# Altium project Benchtest.PrjPcb
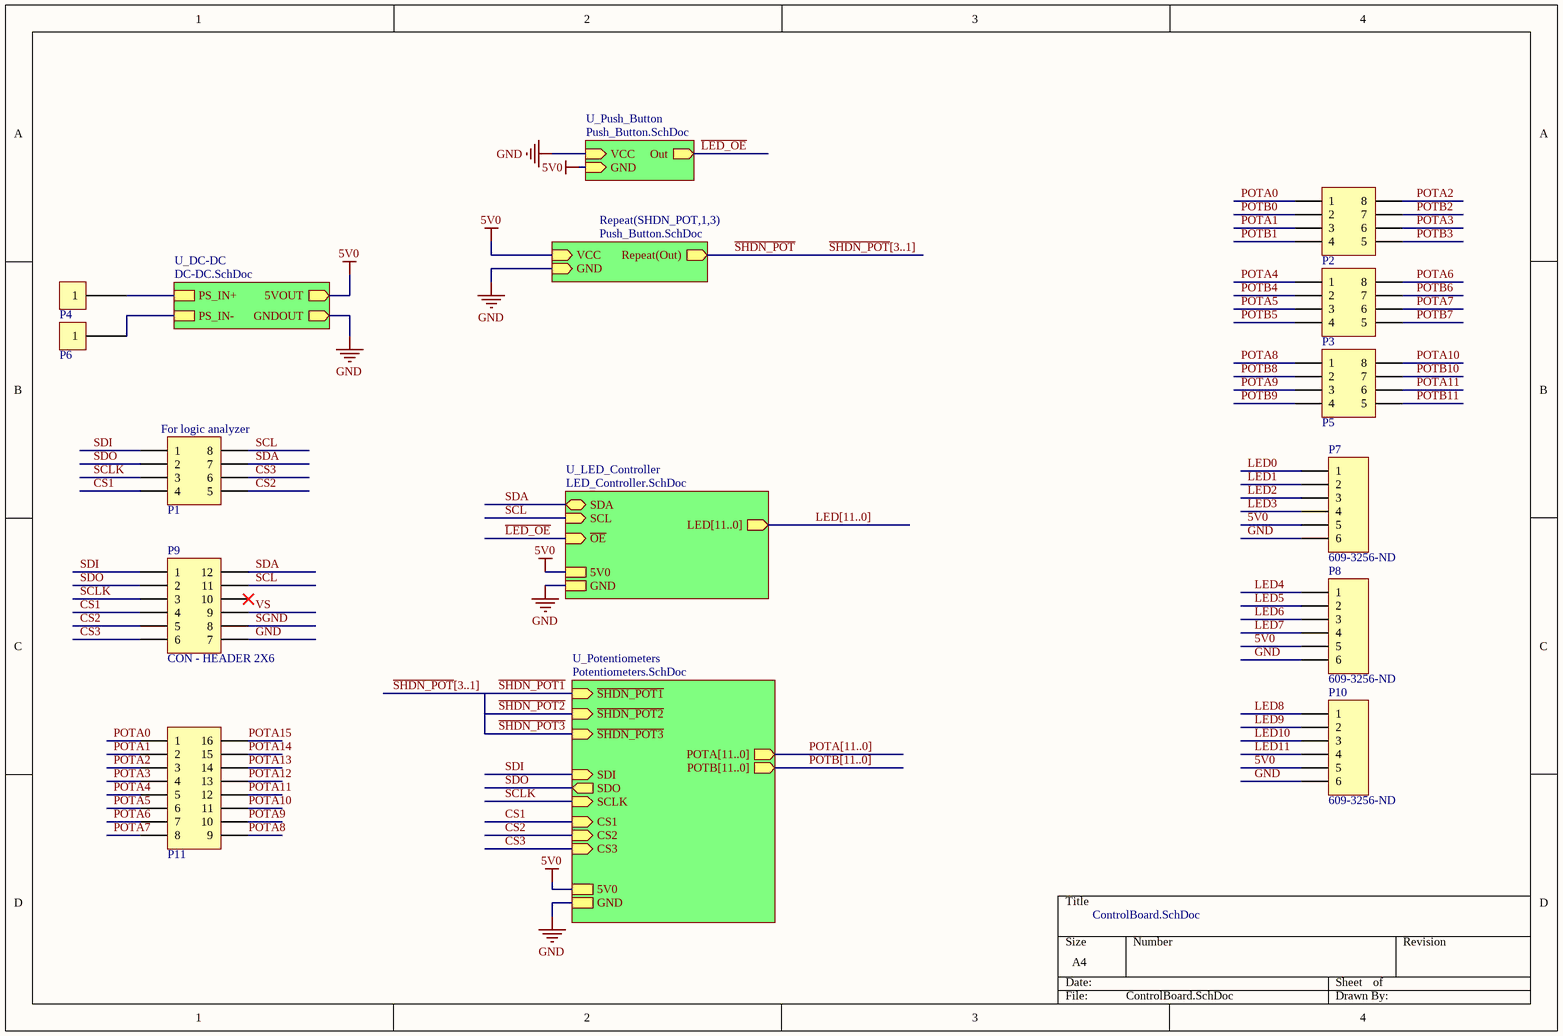
[diagram p0: ControlBoard.SchDoc]
7 sheets, 81 parts. Net scope: hierarchical (ports join the sheet entries above them; power ports are global).
Board file: ControlBoard.PcbDoc
Sheets:
  ControlBoard.SchDoc
    U_LED_Controller = LED_Controller.SchDoc
    U_Potentiometers = Potentiometers.SchDoc
      U_Potentiometer = Potentiometer.SchDoc
      U_Potentiometer = Potentiometer.SchDoc
      U_Potentiometer = Potentiometer.SchDoc
    SHDN_POT1 = Push_Button.SchDoc
    SHDN_POT2 = Push_Button.SchDoc
    SHDN_POT3 = Push_Button.SchDoc
    U_Push_Button = Push_Button.SchDoc
    U_DC-DC = DC-DC.SchDoc
  Signal_Protection.SchDoc

## Sheet ControlBoard.SchDoc
size A4

### Parts
P1  CON - HEADER 2X4  [CON-HEADER-2X4]  (value not drawn)
P2  CON - HEADER 2X4  [CON-HEADER-2X4]  (value not drawn)
P3  CON - HEADER 2X4  [CON-HEADER-2X4]  (value not drawn)
P4  CON - BANANA  [CON-PCB BANANA RED]  (value not drawn)
P5  CON - HEADER 2X4  [CON-HEADER-2X4]  (value not drawn)
P6  CON - BANANA  [CON-PCB BANANA BLACK]  (value not drawn)
P7  Supplier Part Number 1: 609-3256-ND  [CON-HEADER-1X6]  (hidden comment: CON - HEADER 1X6)
P8  Supplier Part Number 1: 609-3256-ND  [CON-HEADER-1X6]  (hidden comment: CON - HEADER 1X6)
P9  CON - HEADER 2X6  [CON-HEADER-2X6]
P10  Supplier Part Number 1: 609-3256-ND  [CON-HEADER-1X6]  (hidden comment: CON - HEADER 1X6)
P11  CON - HEADER 2X8  [CON-HEADER-2X8]  (value not drawn)

### Sub-sheets
Repeat(SHDN_POT,1,3) = Push_Button.SchDoc: Repeat(Out) (out), GND (in), VCC (in)
U_DC-DC = DC-DC.SchDoc: 5VOUT (out), PS_IN+, PS_IN-, GNDOUT (out)
U_LED_Controller = LED_Controller.SchDoc: SDA (bidir), SCL (in), ~{OE} (in), 5V0, GND, LED[11..0] (out)
U_Potentiometers = Potentiometers.SchDoc: SDI (in), SCLK (in), CS1 (in), CS2 (in), CS3 (in), 5V0, GND, SDO (out), ~{SHDN_POT3} (in), ~{SHDN_POT2} (in), ~{SHDN_POT1} (in), POTA[11..0] (out), POTB[11..0] (out)
U_Push_Button = Push_Button.SchDoc: Out (out), VCC (in), GND (in)

### Nets
5V0: P6.1 P7.5 P7.6 P8.5 P8.6 P9.7 P10.5 P10.6 ; sheet U_LED_Controller/5V0, sheet U_LED_Controller/GND, sheet U_Potentiometers/5V0, sheet U_Potentiometers/GND, sheet Repeat(SHDN_POT,1,3)/GND, sheet Repeat(SHDN_POT,1,3)/VCC, sheet U_Push_Button/VCC, sheet U_Push_Button/GND, sheet U_DC-DC/5VOUT, sheet U_DC-DC/PS_IN-, sheet U_DC-DC/GNDOUT  [also labelled GND]
CS1: P1.4 P9.4 ; sheet U_Potentiometers/CS1
CS2: P1.5 P9.5 ; sheet U_Potentiometers/CS2
CS3: P1.6 P9.6 ; sheet U_Potentiometers/CS3
~{LED_OE}: sheet U_LED_Controller/~{OE}, sheet U_Push_Button/Out
LED0: P7.1
LED1: P7.2
LED2: P7.3
LED3: P7.4
LED4: P8.1
LED5: P8.2
LED6: P8.3
LED7: P8.4
LED8: P10.1
LED9: P10.2
LED10: P10.3
LED11: P10.4
POTA0: P2.1 P11.1
POTA1: P2.3 P11.2
POTA2: P2.8 P11.3
POTA3: P2.6 P11.4
POTA4: P3.1 P11.5
POTA5: P3.3 P11.6
POTA6: P3.8 P11.7
POTA7: P3.6 P11.8
POTA8: P5.1 P11.9
POTA9: P5.3 P11.10
POTA10: P5.8 P11.11
POTA11: P5.6 P11.12
POTA12: P11.13
POTA13: P11.14
POTA14: P11.15
POTA15: P11.16
POTB0: P2.2
POTB1: P2.4
POTB2: P2.7
POTB3: P2.5
POTB4: P3.2
POTB5: P3.4
POTB6: P3.7
POTB7: P3.5
POTB8: P5.2
POTB9: P5.4
POTB10: P5.7
POTB11: P5.5
~{SHDN_POT}: sheet Repeat(SHDN_POT,1,3)/Repeat(Out)
SCL: P1.8 P9.11 ; sheet U_LED_Controller/SCL
SCLK: P1.3 P9.3 ; sheet U_Potentiometers/SCLK
SDA: P1.7 P9.12 ; sheet U_LED_Controller/SDA
SDI: P1.1 P9.1 ; sheet U_Potentiometers/SDI
SDO: P1.2 P9.2 ; sheet U_Potentiometers/SDO
SGND: P9.8
VS: P9.9
NetF1_1: P4.1 ; sheet U_DC-DC/PS_IN+

Not connected (* = marked no-connect by the designer): P9 10*

### Buses and harness runs
bus LED[11..0] = sheet U_LED_Controller/LED[11..0]
bus POTA[11..0] = sheet U_Potentiometers/POTA[11..0]
bus POTB[11..0] = sheet U_Potentiometers/POTB[11..0]
bus ~{SHDN_POT}[3..1]

### Notes on the sheet
- (near P1) For logic analyzer

### Library data of the parts
P1-P3 P5 = CON - HEADER 2X4: 100mil header 2 row 8pins; Manufacturer: *; (FIELD A): *; (FIELD B): *; (FIELD C): *; Supplier 1: Digi-Key; Supplier Part Number 1: 952-2122-ND
P7 P8 P10 = CON - HEADER 1X6: 100mil header 1 row 6 pins; Manufacturer: *; (FIELD A): *; (FIELD B): *; (FIELD C): *; Supplier 1: Digi-Key
P9 = CON - HEADER 2X6: 100mil header 2 row 12pins; Manufacturer: *; (FIELD A): *; (FIELD B): *; (FIELD C): *; Supplier 1: Digi-Key; Supplier Part Number 1: 952-2125-ND
P11 = CON - HEADER 2X8: 100mil header 2 row 16pins; Manufacturer: *; (FIELD A): *; (FIELD B): *; (FIELD C): *; Supplier 1: Digi-Key; Supplier Part Number 1: 952-2128-ND
P4 P6 = CON - BANANA: Supplier 1: Digi-Key; Supplier 2: Digi-Key; Supplier Part Number 1: J110-ND; Supplier Part Number 2: J109-ND

## Sheet LED_Controller.SchDoc
size A4
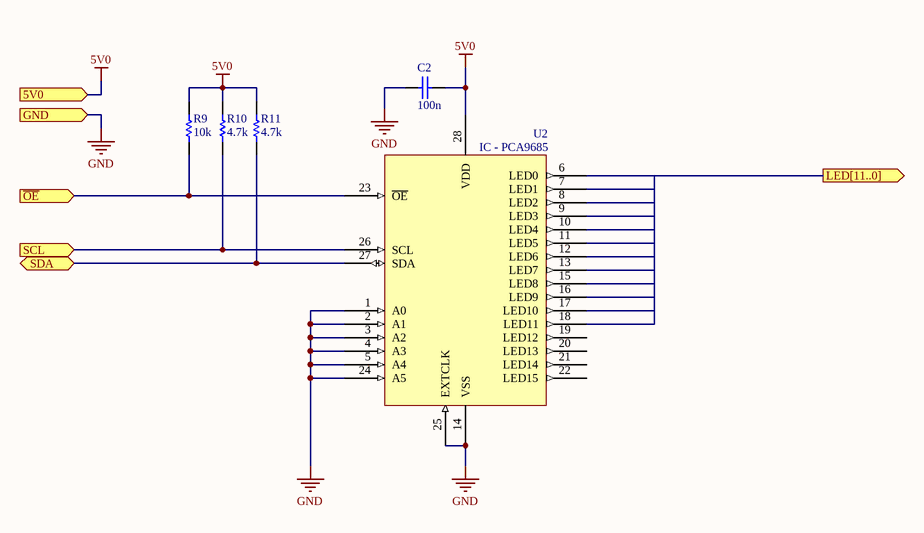
[diagram p1: LED_Controller.SchDoc]

### Parts
C2  value 100n  [CS-0603]  (hidden comment: CS - CAPACITOR)
R9  value 10k  [RS-0402]  (hidden comment: RS - RESISTOR)
R10  value 4.7k  [RS-0402]  (hidden comment: RS - RESISTOR)
R11  value 4.7k  [RS-0402]  (hidden comment: RS - RESISTOR)
U2  IC - PCA9685  [IC-TSSOP-28]

### Ports
5V0, GND, LED[11..0] (out), SCL (in), SDA (bidir), ~{OE} (in)

### Nets
5V0: C2.1 C2.2 R9.2 R10.2 R11.2 U2.1(A0) U2.2(A1) U2.3(A2) U2.4(A3) U2.5(A4) U2.14(VSS) U2.24(A5) U2.25(EXTCLK) U2.28(VDD) ; port 5V0, port GND  [also labelled GND]
~{LED_OE}: R9.1 U2.23(~{OE}) ; port ~{OE}
SCL: R10.1 U2.26(SCL) ; port SCL
SDA: R11.1 U2.27(SDA) ; port SDA

Not connected (* = marked no-connect by the designer): U2 6(LED0) 7(LED1) 8(LED2) 9(LED3) 10(LED4) 11(LED5) 12(LED6) 13(LED7) 15(LED8) 16(LED9) 17(LED10) 18(LED11) 19(LED12) 20(LED13) 21(LED14) 22(LED15)

### Library data of the parts
C2 = CS - CAPACITOR: TOLERANCE: 10%; VOLTAGE: 16V; Supplier 1: *; Supplier Part Number 1: *; (FIELD A): *; (FLIED C): *; (FIELD B): *; Manufacturer: *
R9-R11 = RS - RESISTOR: TOLERANCE: RES TOL; POWER: RES POWER; Supplier Part Number 1: *; Supplier 1: *; (FIELD A): *; (FLIED C): *; (FIELD B): *; Manufacturer: *
U2 = IC - PCA9685: 16-channel, 12-bit PWM Fm + I2C-bus LED controller; Manufacturer: Allegro; Supplier 1: Digi-Key; Supplier Part Number 1: 568-11925-2-ND; (FLIED A): *; (FLIED B): *; (FLIED C): *

## Sheet Potentiometers.SchDoc
size A4
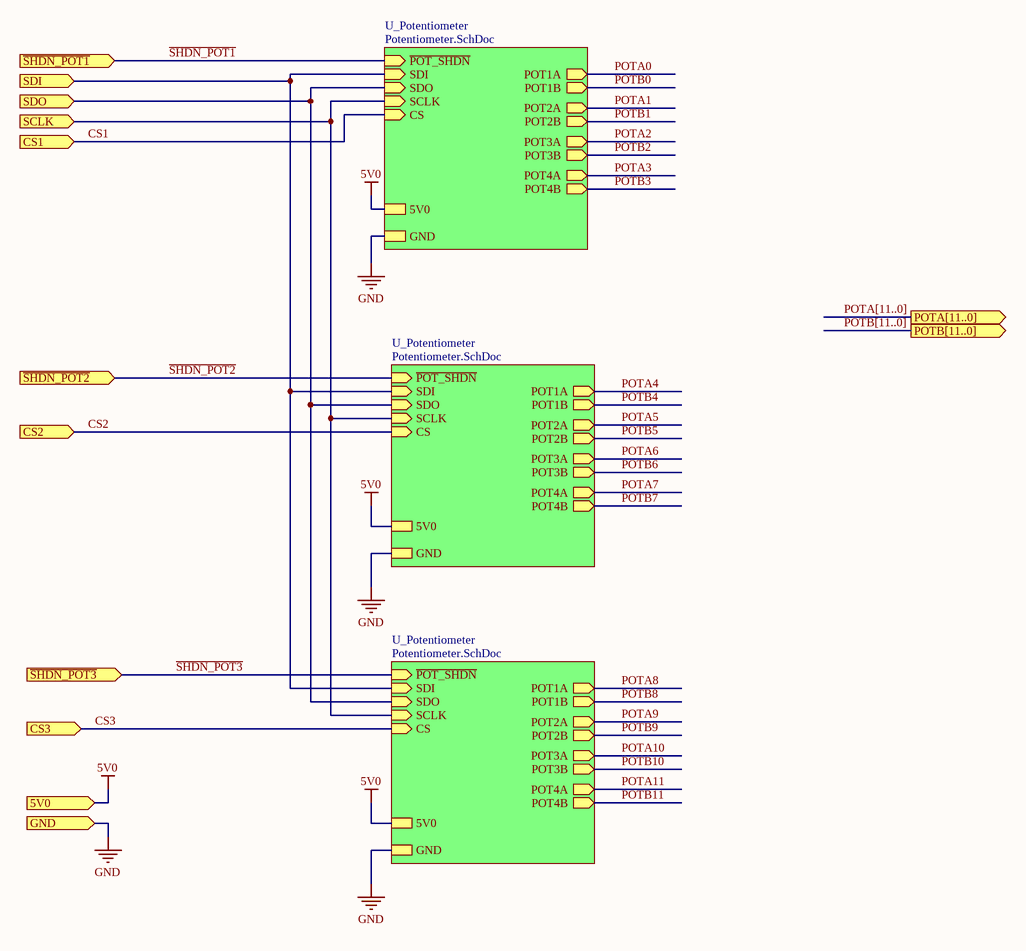
[diagram p2: Potentiometers.SchDoc]

### Sub-sheets
U_Potentiometer = Potentiometer.SchDoc: SDI (in), SDO (in), SCLK (in), CS (in), POT1A (out), POT1B (out), POT2A (out), POT2B (out), POT3A (out), POT3B (out), POT4A (out), POT4B (out), 5V0, GND, ~{POT_SHDN} (in)
U_Potentiometer = Potentiometer.SchDoc: SDI (in), SDO (in), SCLK (in), CS (in), POT1A (out), POT1B (out), POT2A (out), POT2B (out), POT3A (out), POT3B (out), POT4A (out), POT4B (out), 5V0, GND, ~{POT_SHDN} (in)
U_Potentiometer = Potentiometer.SchDoc: SDI (in), SDO (in), SCLK (in), CS (in), POT1A (out), POT1B (out), POT2A (out), POT2B (out), POT3A (out), POT3B (out), POT4A (out), POT4B (out), 5V0, GND, ~{POT_SHDN} (in)

### Ports
5V0, CS1 (in), CS2 (in), CS3 (in), GND, POTA[11..0] (out), POTB[11..0] (out), SCLK (in), SDI (in), SDO (in), ~{SHDN_POT1} (in), ~{SHDN_POT2} (in), ~{SHDN_POT3} (in)

### Nets
5V0: port 5V0, port GND, sheet U_Potentiometer/5V0, sheet U_Potentiometer/GND, sheet U_Potentiometer/5V0, sheet U_Potentiometer/GND, sheet U_Potentiometer/5V0, sheet U_Potentiometer/GND  [also labelled GND]
CS1: port CS1, sheet U_Potentiometer/CS
CS2: port CS2, sheet U_Potentiometer/CS
CS3: port CS3, sheet U_Potentiometer/CS
~{SHDN_POT1}: port ~{SHDN_POT1}, sheet U_Potentiometer/~{POT_SHDN}
~{SHDN_POT2}: port ~{SHDN_POT2}, sheet U_Potentiometer/~{POT_SHDN}
~{SHDN_POT3}: port ~{SHDN_POT3}, sheet U_Potentiometer/~{POT_SHDN}
SCLK: port SCLK, sheet U_Potentiometer/SCLK, sheet U_Potentiometer/SCLK, sheet U_Potentiometer/SCLK
SDI: port SDI, sheet U_Potentiometer/SDI, sheet U_Potentiometer/SDI, sheet U_Potentiometer/SDI
SDO: port SDO, sheet U_Potentiometer/SDO, sheet U_Potentiometer/SDO, sheet U_Potentiometer/SDO

### Buses and harness runs
bus POTA[11..0] = port POTA[11..0]
bus POTB[11..0] = port POTB[11..0]

## Sheet Potentiometer.SchDoc
size A4
Used 3 times, as channels U_Potentiometers/U_Potentiometer, U_Potentiometers/U_Potentiometer, U_Potentiometers/U_Potentiometer. Parts and nets are listed once, with the designators drawn on the sheet.
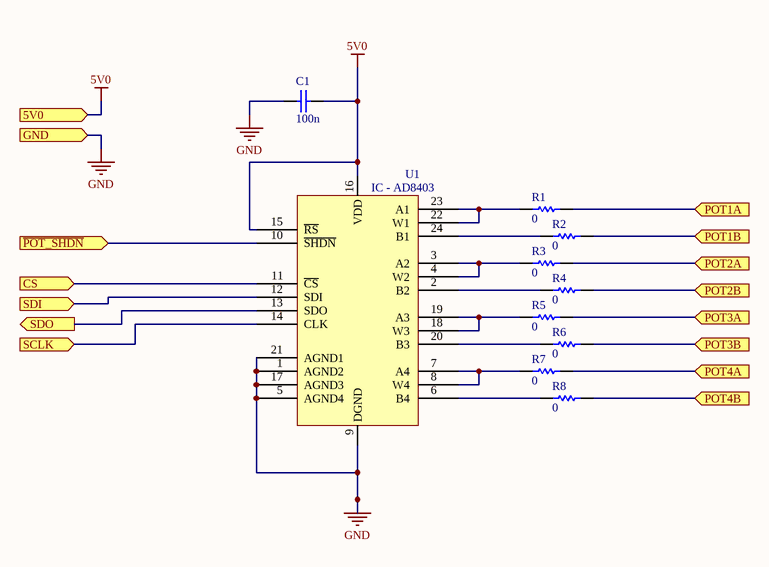
[diagram p3: Potentiometer.SchDoc]

### Parts
C1  value 100n  [CS-0603]  (hidden comment: CS - CAPACITOR)
R1  value 0  [RS-0402]  (hidden comment: RS - RESISTOR)
R2  value 0  [RS-0402]  (hidden comment: RS - RESISTOR)
R3  value 0  [RS-0402]  (hidden comment: RS - RESISTOR)
R4  value 0  [RS-0402]  (hidden comment: RS - RESISTOR)
R5  value 0  [RS-0402]  (hidden comment: RS - RESISTOR)
R6  value 0  [RS-0402]  (hidden comment: RS - RESISTOR)
R7  value 0  [RS-0402]  (hidden comment: RS - RESISTOR)
R8  value 0  [RS-0402]  (hidden comment: RS - RESISTOR)
U1  IC - AD8403  [IC-SOIC-24]

### Ports
5V0, CS (in), GND, POT1A (in), POT1B (in), POT2A (in), POT2B (in), POT3A (in), POT3B (in), POT4A (in), POT4B (in), SCLK (in), SDI (in), SDO (out), ~{POT_SHDN} (in)

### Nets
5V0: C1.1 U1.15(~{RS}) U1.16(VDD) ; port 5V0
GND: C1.2 U1.1(AGND2) U1.5(AGND4) U1.9(DGND) U1.17(AGND3) U1.21(AGND1) ; port GND
CS: U1.11(~{CS}) ; port CS
~{POT_SHDN}: U1.10(~{SHDN}) ; port ~{POT_SHDN}
POT1A: R1.1 ; port POT1A
POT1B: R2.1 ; port POT1B
POT2A: R3.1 ; port POT2A
POT2B: R4.1 ; port POT2B
POT3A: R5.1 ; port POT3A
POT3B: R6.1 ; port POT3B
POT4A: R7.1 ; port POT4A
POT4B: R8.1 ; port POT4B
SCLK: U1.14(CLK) ; port SCLK
SDI: U1.12(SDI) ; port SDI
SDO: U1.13(SDO) ; port SDO
NetR1_2: R1.2 U1.22(W1) U1.23(A1)
NetR2_2: R2.2 U1.24(B1)
NetR3_2: R3.2 U1.3(A2) U1.4(W2)
NetR4_2: R4.2 U1.2(B2)
NetR5_2: R5.2 U1.18(W3) U1.19(A3)
NetR6_2: R6.2 U1.20(B3)
NetR7_2: R7.2 U1.7(A4) U1.8(W4)
NetR8_2: R8.2 U1.6(B4)

### Channels
U_Potentiometers/U_Potentiometer: designators end in _U_Potentiometer3; ports 5V0=5V0 CS=CS3 GND=5V0 POT1A=POTA8 POT1B=POTB8 POT2A=POTA9 POT2B=POTB9 POT3A=POTA10 POT3B=POTB10 POT4A=POTA11 POT4B=POTB11 SCLK=SCLK SDI=SDI SDO=SDO ~{POT_SHDN}=~{SHDN_POT3}
U_Potentiometers/U_Potentiometer: designators end in _U_Potentiometer2; ports 5V0=5V0 CS=CS1 GND=5V0 POT1A=POTA0 POT1B=POTB0 POT2A=POTA1 POT2B=POTB1 POT3A=POTA2 POT3B=POTB2 POT4A=POTA3 POT4B=POTB3 SCLK=SCLK SDI=SDI SDO=SDO ~{POT_SHDN}=~{SHDN_POT1}
U_Potentiometers/U_Potentiometer: designators end in _U_Potentiometer1; ports 5V0=5V0 CS=CS2 GND=5V0 POT1A=POTA4 POT1B=POTB4 POT2A=POTA5 POT2B=POTB5 POT3A=POTA6 POT3B=POTB6 POT4A=POTA7 POT4B=POTB7 SCLK=SCLK SDI=SDI SDO=SDO ~{POT_SHDN}=~{SHDN_POT2}

### Library data of the parts
C1 = CS - CAPACITOR: TOLERANCE: 10%; VOLTAGE: 16V; Supplier 1: *; Supplier Part Number 1: *; (FIELD A): *; (FLIED C): *; (FIELD B): *; Manufacturer: *
R1-R8 = RS - RESISTOR: TOLERANCE: RES TOL; POWER: RES POWER; Supplier Part Number 1: *; Supplier 1: *; (FIELD A): *; (FLIED C): *; (FIELD B): *; Manufacturer: *
U1 = IC - AD8403: DIGITAL POTENTIOMETER; (FIELD A): *; (FIELD B): *; (FIELD C): *; Manufacturer: *; Supplier 1: Digi-Key; Supplier Part Number 1: AD8403ARZ10-ND

## Sheet Push_Button.SchDoc
size A4
Used 4 times, as channels SHDN_POT1, SHDN_POT2, SHDN_POT3, U_Push_Button. Parts and nets are listed once, with the designators drawn on the sheet.
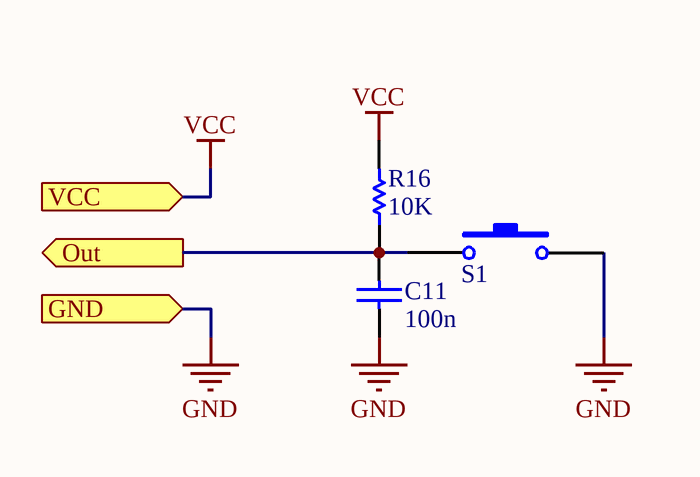
[diagram p4: Push_Button.SchDoc]

### Parts
C11  value 100n  [CS-0603]  (hidden comment: CS - CAPACITOR)
R16  value 10K  [RS-0603]  (hidden comment: RS - RESISTOR)
S1  SW - Tactile Switch  [SW-FSMSM]  (value not drawn)

### Ports
GND (in), Out (out), VCC (in)

### Nets
GND: C11.1 S1.2 ; port GND
VCC: R16.2 ; port VCC
Out: C11.2 R16.1 S1.1 ; port Out

### Channels
SHDN_POT1: designators end in _SHDN_POT1; ports GND=5V0 Out=~{SHDN_POT}1 VCC=5V0
SHDN_POT2: designators end in _SHDN_POT2; ports GND=5V0 Out=~{SHDN_POT}2 VCC=5V0
SHDN_POT3: designators end in _SHDN_POT3; ports GND=5V0 Out=~{SHDN_POT}3 VCC=5V0
U_Push_Button: designators end in _U_Push_Button; ports GND=5V0 Out=~{LED_OE} VCC=5V0

### Library data of the parts
C11 = CS - CAPACITOR: TOLERANCE: 10%; VOLTAGE: 16V; Supplier 1: *; Supplier Part Number 1: 490-1532-1-ND; (FIELD A): *; (FLIED C): *; (FIELD B): *; Manufacturer: *
R16 = RS - RESISTOR: TOLERANCE: RES TOL; POWER: RES POWER; Supplier Part Number 1: *; Supplier 1: *; (FIELD A): *; (FLIED C): *; (FIELD B): *; Manufacturer: *
S1 = SW - Tactile Switch: Supplier 1: Digi-Key; Supplier Part Number 1: 450-1658-ND; (FLIED A): *; (FLIED B): *; (FLIED C): *; Manufacturer: *; Supplier 2: Digi-Key; Supplier Part Number 2: 450-1758-2-ND

## Sheet DC-DC.SchDoc
size A4
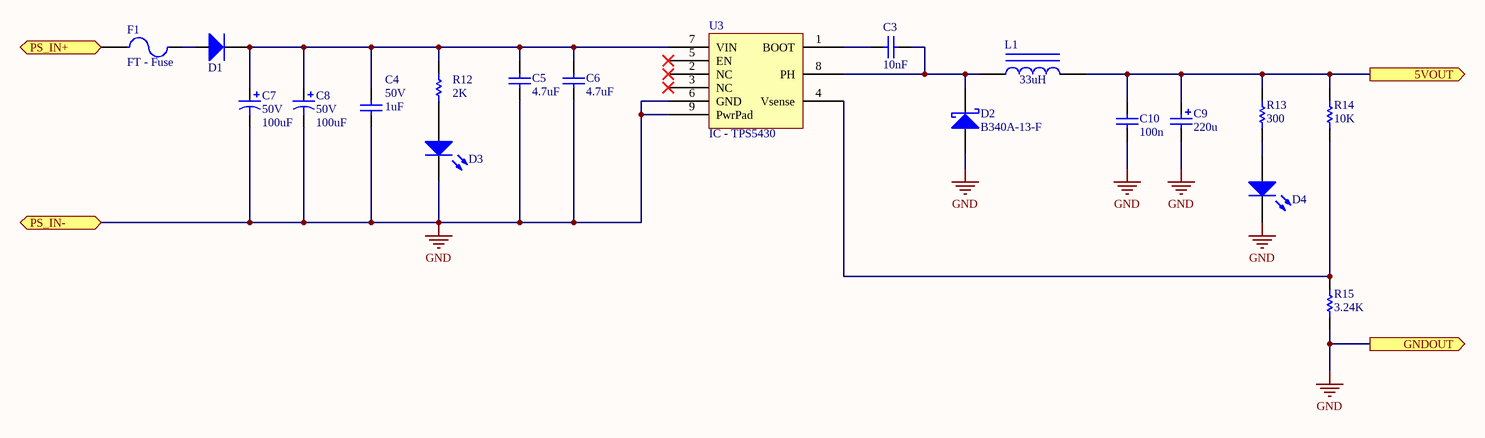
[diagram p5: DC-DC.SchDoc]

### Parts
C3  value 10nF  [CS-0603]  (hidden comment: CS - CAPACITOR)
C4  value 1uF  VOLTAGE: 50V  [CS-0603]  (hidden comment: CS - CAPACITOR)
C5  value 4.7uF  [CS-1206]  (hidden comment: CS - CAPACITOR)
C6  value 4.7uF  [CS-1206]  (hidden comment: CS - CAPACITOR)
C7  value 100uF  VOLTAGE: 50V  [CT-CAP-ALUM-8X14]  (hidden comment: CT - CAPACITOR ELECTROLYTIC)
C8  value 100uF  VOLTAGE: 50V  [CT-CAP-ALUM-8X14]  (hidden comment: CT - CAPACITOR ELECTROLYTIC)
C9  value 220u  [CS-POL-2312]  (hidden comment: CS - CAPACITOR POL)
C10  value 100n  [CS-0603]  (hidden comment: CS - CAPACITOR)
D1  DT - Diode  [IC-TO-220-2-DIODE]  (value not drawn)
D2  B340A-13-F  [DS - DO-214AC-SMA]
D3  LED - NORMAL LED  [LED-0603 YELLOW]  (value not drawn)
D4  LED - NORMAL LED  [LED-0603 YELLOW]  (value not drawn)
F1  FT - Fuse  [FT - 5mm x 20mm]
L1  value 33uH  [LS-Inductor SMD]  (hidden comment: LS - INDUCTOR)
R12  value 2K  [RS-0603]  (hidden comment: RS - RESISTOR)
R13  value 300  [RS-0603]  (hidden comment: RS - RESISTOR)
R14  value 10K  [RS-0603]  (hidden comment: RS - RESISTOR)
R15  value 3.24K  [RS-0603]  (hidden comment: RS - RESISTOR)
U3  IC - TPS5430  [IC-SOIC8-POWERPAD]

### Ports
5VOUT (out), GNDOUT (out), PS_IN+, PS_IN-

### Nets
GND: C4.1 C5.1 C6.1 C7.2 C8.2 C9.1 C9.2 C10.1 C10.2 D2.A D3.K D4.K L1.2 R13.1 R14.1 R15.2 U3.6(GND) U3.9(PwrPad) ; port 5VOUT, port PS_IN-, port GNDOUT  [project net 5V0]
NetC3_1: C3.1 D2.K L1.1 U3.8(PH)
NetC3_2: C3.2 U3.1(BOOT)
NetC4_2: C4.2 C5.2 C6.2 C7.1 C8.1 D1.K R12.2 U3.7(VIN)
NetD1_A: D1.A F1.2
NetD3_A: D3.A R12.1
NetD4_A: D4.A R13.2
NetF1_1: F1.1 ; port PS_IN+
NetR14_2: R14.2 R15.1 U3.4(Vsense)

Not connected (* = marked no-connect by the designer): U3 2(NC)* 3(NC)* 5(EN)*

### Library data of the parts
C3 = CS - CAPACITOR: CAP CER 10000PF 50V 10% X7R 0603; Manufacturer: TDK; (FIELD A): Tantalum; VOLTAGE: 16V; Supplier 1: Digikey; Supplier Part Number 1: 445-1311-1-ND; (FLIED C): *; (FIELD B): *; TOLERANCE: 10%
C4 = CS - CAPACITOR: TOLERANCE: 10%; Supplier 1: *; Supplier Part Number 1: *; (FIELD A): *; (FLIED C): *; (FIELD B): *; Manufacturer: *
C5 C6 = CS - CAPACITOR: Manufacturer: Samsung; TOLERANCE: 10%; VOLTAGE: 16V; Supplier 1: Digikey; Supplier Part Number 1: 1276-1292-1-ND; (FIELD A): *; (FLIED C): *; (FIELD B): *
C7 C8 = CT - CAPACITOR ELECTROLYTIC: TOLERANCE: 10%; Supplier 1: *; Supplier Part Number 1: *; (FIELD A): *; (FLIED C): *; (FIELD B): *; Manufacturer: *
C9 = CS - CAPACITOR POL: TOLERANCE: 10%; Supplier 1: *; Supplier Part Number 1: *; (FIELD A): *; (FLIED C): *; (FIELD B): *; Manufacturer: *; VOLTAGE: VOLTAGE; Supplier 2: Digi-Key; Supplier Part Number 2: 478-5236-1-ND
C10 = CS - CAPACITOR: TOLERANCE: 10%; VOLTAGE: 16V; Supplier 1: *; Supplier Part Number 1: 490-1532-1-ND; (FIELD A): *; (FLIED C): *; (FIELD B): *; Manufacturer: *
D1 = DT - Diode: Zener Schottky; Supplier Part Number 1: *; Supplier 1: *; FORWARS VOLTAGE: *; (FIELD A): *; (FIELD B): *; (FIELD C): *; Manufacturer: *; CURRENT MAX: *; Supplier 2: Digi-Key; Supplier Part Number 2: MBR1645-E3/45GI-ND
D2 = DS - Schottky: DIODE SCHOTTKY 40V 3A SMA; Manufacturer: Diodes Incorporated; Supplier Part Number 1: B340A-FDICT-ND; Supplier 1: Digikey; FORWARS VOLTAGE: *; (FIELD A): *; (FIELD B): *; (FIELD C): *; Supplier 2: Digi-Key; Supplier Part Number 2: B340A-FDICT-ND
F1 = FT - Fuse: Manufacturer: Schurter Inc; Supplier 1: Digikey; Supplier Part Number 1: 486-1259-ND
L1 = LS - INDUCTOR: INDUCTOR SHIELD PWR; Manufacturer: Bourns Inc; CURRENT: 2.8A; IMAX: 3A; (FIELD A): *; (FIELD B): *; (FIELD C): *; RESISTOR: *; Supplier 1: Digikey; Supplier Part Number 1: SRR1260-330M
R12 = RS - RESISTOR: TOLERANCE: RES TOL; POWER: 1/10W; Supplier Part Number 1: *; Supplier 1: *; (FIELD A): *; (FLIED C): *; (FIELD B): *; Manufacturer: *
R13-R15 = RS - RESISTOR: TOLERANCE: RES TOL; POWER: RES POWER; Supplier Part Number 1: *; Supplier 1: *; (FIELD A): *; (FLIED C): *; (FIELD B): *; Manufacturer: *
U3 = IC - TPS5430: IC REG BUCK ADJ 3A 8SOPWRPAD; Manufacturer: Texas Instruments; Part Number: TPS5430; Supplier 1: Digi-Key; Supplier Part Number 1: 296-26988-1-ND
D3 D4 = LED - NORMAL LED: FORWARS VOLTAGE: *; CURRENT: *; COLOR: *; Supplier Part Number 1: *; Supplier 1: *; (FIELD B): *; (FIELD A): *; (FIELD C): *; Manufacturer: *

## Sheet Signal_Protection.SchDoc
size A4
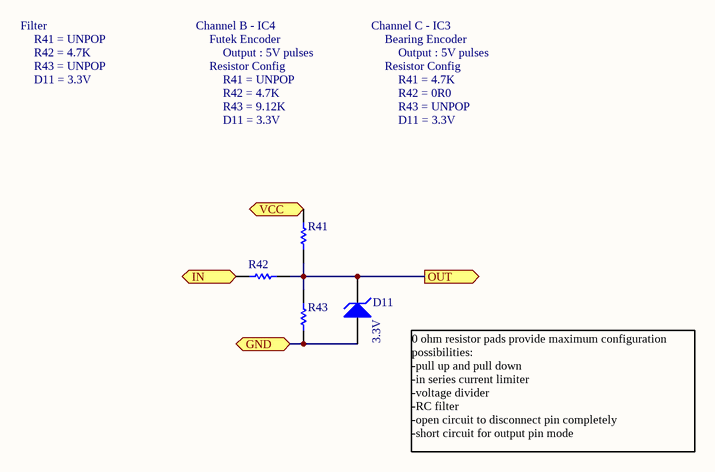
[diagram p6: Signal_Protection.SchDoc]

### Parts
D11  Voltage - Reverse Standoff (Typ): 3.3V  [DS-SOD523]  (hidden comment: DS - TVS ESD5Z3.3T1G)
R41  RS - RESISTOR  [RS-0603]  (value not drawn)
R42  RS - RESISTOR  [RS-0603]  (value not drawn)
R43  RS - RESISTOR  [RS-0603]  (value not drawn)

### Ports
GND, IN (in), OUT (out), VCC

### Nets
NetD11_A: D11.A R43.1 ; port GND
NetD11_K: D11.K R41.2 R42.1 R43.2 ; port OUT
NetR41_1: R41.1 ; port VCC
NetR42_2: R42.2 ; port IN

### Notes on the sheet
- Filter
- R41 = UNPOP
- R42 = 4.7K
- R43 = UNPOP
- D11 = 3.3V
- Channel B - IC4
- Futek Encoder
- Resistor Config
- Output : 5V pulses
- Channel C - IC3
- Bearing Encoder
- R41 = 4.7K
- R43 = 9.12K
- R42 = 0R0
- 0 ohm resistor pads provide maximum configuration possibilities:
  -pull up and pull down
  -in series current limiter
  -voltage divider
  -RC filter
  -open circuit to disconnect pin completely
  -short circuit for output pin mode

### Library data of the parts
D11 = DS - TVS ESD5Z3.3T1G: TVS 3.3V; Manufacturer: ON Semiconductor; FORWARS VOLTAGE: *; (FIELD A): *; (FIELD B): *; Supplier 1: Digi-Key; Supplier Part Number 1: ESD5Z3.3T1GOSCT-ND
R41-R43 = RS - RESISTOR: TOLERANCE: RES TOL; POWER: RES POWER; Supplier Part Number 1: *; Supplier 1: *; (FIELD A): *; (FLIED C): *; (FIELD B): *; Manufacturer: *

## Nets that join several sheets
5V0: ControlBoard (8 pins), LED_Controller (14 pins), U_Potentiometers/U_Potentiometer (9 pins), U_Potentiometers/U_Potentiometer (9 pins), U_Potentiometers/U_Potentiometer (9 pins), SHDN_POT1 (C11_SHDN_POT1.1 R16_SHDN_POT1.2 S1_SHDN_POT1.2), SHDN_POT2 (C11_SHDN_POT2.1 R16_SHDN_POT2.2 S1_SHDN_POT2.2), SHDN_POT3 (C11_SHDN_POT3.1 R16_SHDN_POT3.2 S1_SHDN_POT3.2), U_Push_Button (C11_U_Push_Button.1 R16_U_Push_Button.2 S1_U_Push_Button.2), DC-DC (18 pins)
CS1: ControlBoard (P1.4 P9.4), U_Potentiometers/U_Potentiometer (U1_U_Potentiometer2.11)
CS2: ControlBoard (P1.5 P9.5), U_Potentiometers/U_Potentiometer (U1_U_Potentiometer1.11)
CS3: ControlBoard (P1.6 P9.6), U_Potentiometers/U_Potentiometer (U1_U_Potentiometer3.11)
~{LED_OE}: LED_Controller (R9.1 U2.23), U_Push_Button (C11_U_Push_Button.2 R16_U_Push_Button.1 S1_U_Push_Button.1)
NetF1_1: ControlBoard (P4.1), DC-DC (F1.1)
POTA0: ControlBoard (P2.1 P11.1), U_Potentiometers/U_Potentiometer (R1_U_Potentiometer2.1)
POTA1: ControlBoard (P2.3 P11.2), U_Potentiometers/U_Potentiometer (R3_U_Potentiometer2.1)
POTA2: ControlBoard (P2.8 P11.3), U_Potentiometers/U_Potentiometer (R5_U_Potentiometer2.1)
POTA3: ControlBoard (P2.6 P11.4), U_Potentiometers/U_Potentiometer (R7_U_Potentiometer2.1)
POTA4: ControlBoard (P3.1 P11.5), U_Potentiometers/U_Potentiometer (R1_U_Potentiometer1.1)
POTA5: ControlBoard (P3.3 P11.6), U_Potentiometers/U_Potentiometer (R3_U_Potentiometer1.1)
POTA6: ControlBoard (P3.8 P11.7), U_Potentiometers/U_Potentiometer (R5_U_Potentiometer1.1)
POTA7: ControlBoard (P3.6 P11.8), U_Potentiometers/U_Potentiometer (R7_U_Potentiometer1.1)
POTA8: ControlBoard (P5.1 P11.9), U_Potentiometers/U_Potentiometer (R1_U_Potentiometer3.1)
POTA9: ControlBoard (P5.3 P11.10), U_Potentiometers/U_Potentiometer (R3_U_Potentiometer3.1)
POTA10: ControlBoard (P5.8 P11.11), U_Potentiometers/U_Potentiometer (R5_U_Potentiometer3.1)
POTA11: ControlBoard (P5.6 P11.12), U_Potentiometers/U_Potentiometer (R7_U_Potentiometer3.1)
POTB0: ControlBoard (P2.2), U_Potentiometers/U_Potentiometer (R2_U_Potentiometer2.1)
POTB1: ControlBoard (P2.4), U_Potentiometers/U_Potentiometer (R4_U_Potentiometer2.1)
POTB2: ControlBoard (P2.7), U_Potentiometers/U_Potentiometer (R6_U_Potentiometer2.1)
POTB3: ControlBoard (P2.5), U_Potentiometers/U_Potentiometer (R8_U_Potentiometer2.1)
POTB4: ControlBoard (P3.2), U_Potentiometers/U_Potentiometer (R2_U_Potentiometer1.1)
POTB5: ControlBoard (P3.4), U_Potentiometers/U_Potentiometer (R4_U_Potentiometer1.1)
POTB6: ControlBoard (P3.7), U_Potentiometers/U_Potentiometer (R6_U_Potentiometer1.1)
POTB7: ControlBoard (P3.5), U_Potentiometers/U_Potentiometer (R8_U_Potentiometer1.1)
POTB8: ControlBoard (P5.2), U_Potentiometers/U_Potentiometer (R2_U_Potentiometer3.1)
POTB9: ControlBoard (P5.4), U_Potentiometers/U_Potentiometer (R4_U_Potentiometer3.1)
POTB10: ControlBoard (P5.7), U_Potentiometers/U_Potentiometer (R6_U_Potentiometer3.1)
POTB11: ControlBoard (P5.5), U_Potentiometers/U_Potentiometer (R8_U_Potentiometer3.1)
SCL: ControlBoard (P1.8 P9.11), LED_Controller (R10.1 U2.26)
SCLK: ControlBoard (P1.3 P9.3), U_Potentiometers/U_Potentiometer (U1_U_Potentiometer3.14), U_Potentiometers/U_Potentiometer (U1_U_Potentiometer2.14), U_Potentiometers/U_Potentiometer (U1_U_Potentiometer1.14)
SDA: ControlBoard (P1.7 P9.12), LED_Controller (R11.1 U2.27)
SDI: ControlBoard (P1.1 P9.1), U_Potentiometers/U_Potentiometer (U1_U_Potentiometer3.12), U_Potentiometers/U_Potentiometer (U1_U_Potentiometer2.12), U_Potentiometers/U_Potentiometer (U1_U_Potentiometer1.12)
SDO: ControlBoard (P1.2 P9.2), U_Potentiometers/U_Potentiometer (U1_U_Potentiometer3.13), U_Potentiometers/U_Potentiometer (U1_U_Potentiometer2.13), U_Potentiometers/U_Potentiometer (U1_U_Potentiometer1.13)